# Altium schematic sheet Sheet1.SchDoc
size A
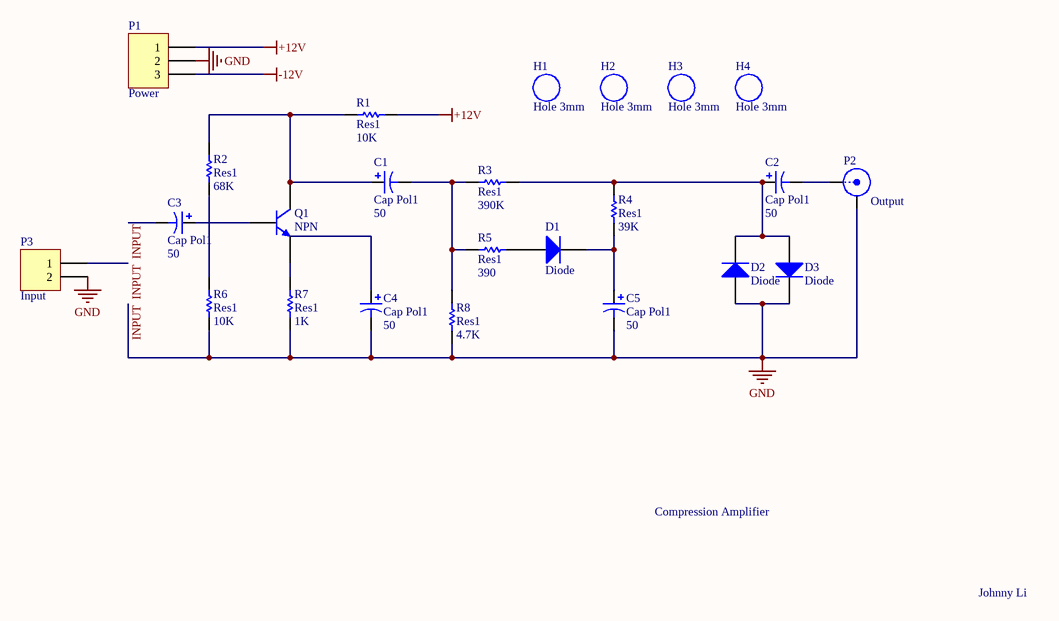
[diagram p0: Sheet1.SchDoc]

## Parts
C1  Cap Pol1  value 50  [RB7.6-15]
C2  Cap Pol1  value 50  [RB7.6-15]
C3  Cap Pol1  value 50  [RB7.6-15]
C4  Cap Pol1  value 50  [RB7.6-15]
C5  Cap Pol1  value 50  [RB7.6-15]
D1  Diode  [SMC]
D2  Diode  [SMC]
D3  Diode  [SMC]
H1  Hole 3mm  [Hole 3mm]
H2  Hole 3mm  [Hole 3mm]
H3  Hole 3mm  [Hole 3mm]
H4  Hole 3mm  [Hole 3mm]
P1  Power  [HDR1X3]
P2  Output  [BNC_RA CON]
P3  Input  [HDR1X2]
Q1  NPN  [TO-226-AA]
R1  Res1  value 10K  [AXIAL-0.3]
R2  Res1  value 68K  [AXIAL-0.3]
R3  Res1  value 390K  [AXIAL-0.3]
R4  Res1  value 39K  [AXIAL-0.3]
R5  Res1  value 390  [AXIAL-0.3]
R6  Res1  value 10K  [AXIAL-0.3]
R7  Res1  value 1K  [AXIAL-0.3]
R8  Res1  value 4.7K  [AXIAL-0.3]

## Nets
+12V: P1.1 R1.2
-12V: P1.3
INPUT: C3.2 C4.2 C5.2 D2.1(A) D3.2(K) P1.2 P2.2(Y) P3.1 P3.2 R6.1 R7.1 R8.1  [also labelled GND]
NetC1_1: C1.1 Q1.1(C) R1.1 R2.2
NetC1_2: C1.2 R3.2 R5.2 R8.2
NetC2_1: C2.1 D2.2(K) D3.1(A) R3.1 R4.1
NetC2_2: C2.2 P2.1(X)
NetC3_1: C3.1 Q1.2(B)
NetC5_1: C5.1 D1.2(K) R4.2
NetD1_1: D1.1(A) R5.1
NetQ1_3: Q1.3(E) R7.2
NetR2_1: R2.1 R6.2

Not connected (* = marked no-connect by the designer): C4 1

## Notes on the sheet
- Compression Amplifier
- Johnny Li

## Library data of the parts
C1-C5 = Cap Pol1: Polarized Capacitor (Radial); Published: 8-Jun-2000; LatestRevisionDate: 17-Jul-2002; LatestRevisionNote: Re-released for DXP Platform.; PackageReference: RB7.6-15; Publisher: Altium Limited; PackageDescription: Polarized Capacitor (Radial); 2 Leads
D1-D3 = Diode: Default Diode; Published: 8-Jun-2000; LatestRevisionDate: 17-Jul-2002; LatestRevisionNote: Re-released for DXP Platform.; PackageVersion: Sep-1996; PackageReference: SMC; Publisher: Altium Limited; PackageDescription: DO-214-AB/SMC; 2 C-Bend Leads; Body 7.9 x 5.9 mm, inc. leads (LxW); Code_JEDEC: DO-214-AB
P1 = Header 3: Header, 3-Pin; LatestRevisionDate: 17-Jul-2002; LatestRevisionNote: Re-released for DXP Platform.; Publisher: Altium Limited
P2 = BNC: BNC Elbow Connector; LatestRevisionDate: 17-Jul-2002; LatestRevisionNote: Re-released for DXP Platform.; Publisher: Altium Limited
P3 = Header 2: Header, 2-Pin; LatestRevisionDate: 17-Jul-2002; LatestRevisionNote: Re-released for DXP Platform.; Publisher: Altium Limited
Q1 = NPN: NPN Bipolar Transistor; Published: 8-Jun-2000; LatestRevisionDate: 17-Jul-2002; LatestRevisionNote: Re-released for DXP Platform.; PackageReference: TO-226-AA; Publisher: Altium Limited; PackageDescription: TO, Flat Index; 3 In-Line, Axial Leads; Body Dia. 4.8mm; Leads 0.55 x 0.51 mm (max); Code_JEDEC: TO-226-AA
R1-R8 = Res1: Resistor; Published: 8-Jun-2000; LatestRevisionDate: 17-Jul-2002; LatestRevisionNote: Re-released for DXP Platform.; PackageReference: AXIAL-0.3; Publisher: Altium Limited; PackageDescription: Axial Device, Thru-Hole; 2 Leads; 0.3 in Pin Spacing